# Altium schematic sheet main-board.SchDoc
size A; SheetNumber: 1; SheetTotal: 5
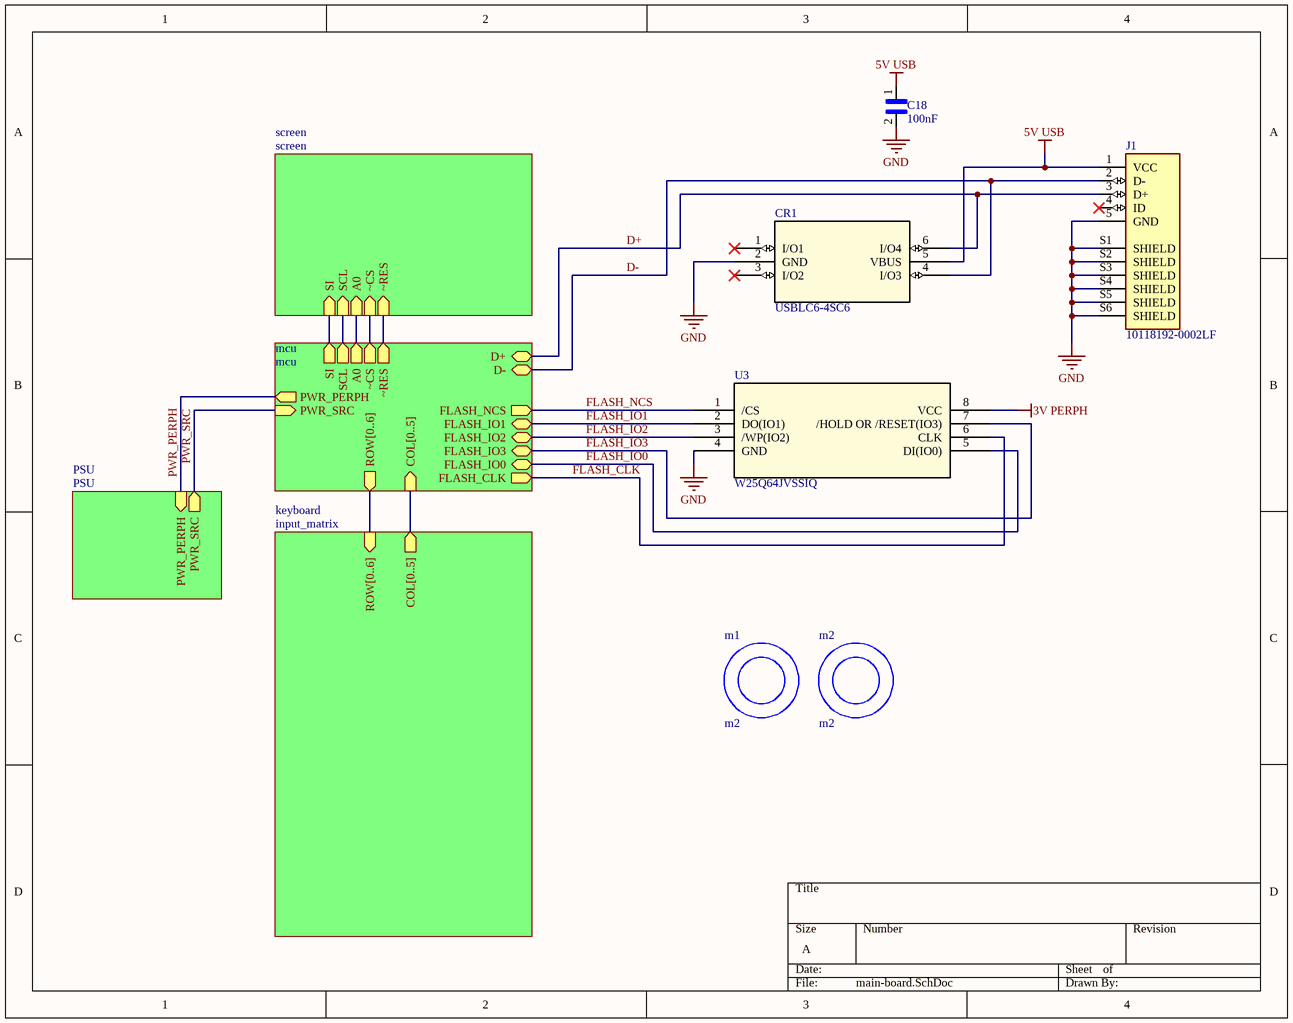
[diagram p0: main-board.SchDoc]

## Parts
C18  100nF  [CAPC1005X55N]
CR1  USBLC6-4SC6  [SOT23-6L_STM]
J1  10118192-0002LF  [AMPHENOL_10118192-0002LF]
m1  m2  [m2]
m2  m2  [m2]
U3  W25Q64JVSSIQ  [SOIC-8_5P28X5P28_WIN]

## Sub-sheets
keyboard = input_matrix: ROW[0..6] (in), COL[0..5] (out)
mcu = mcu: ROW[0..6] (out), COL[0..5] (in), SI (out), SCL (out), A0 (out), ~CS (out), ~RES (out), FLASH_IO1 (bidir), FLASH_IO0 (bidir), FLASH_CLK (out), FLASH_NCS (out), FLASH_IO2 (bidir), FLASH_IO3 (bidir), PWR_SRC (in), D- (bidir), D+ (bidir), PWR_PERPH (out)
PSU = PSU: PWR_SRC (out), PWR_PERPH (in)
screen = screen: SI (in), SCL (in), A0 (in), ~CS (in), ~RES (in)

## Nets
3V PERPH: U3.8(VCC)
5V USB: C18.1 CR1.5(VBUS) J1.1(VCC)
GND: C18.2 CR1.2(GND) J1.5(GND) J1.S1(SHIELD) J1.S2(SHIELD) J1.S3(SHIELD) J1.S4(SHIELD) J1.S5(SHIELD) J1.S6(SHIELD) U3.4(GND)
D+: CR1.6(I/O4) J1.3(D+) ; sheet mcu/D+
D-: CR1.4(I/O3) J1.2(D-) ; sheet mcu/D-
FLASH_CLK: U3.6(CLK) ; sheet mcu/FLASH_CLK
FLASH_IO0: U3.5(DI(IO0)) ; sheet mcu/FLASH_IO0
FLASH_IO1: U3.2(DO(IO1)) ; sheet mcu/FLASH_IO1
FLASH_IO2: U3.3(/WP(IO2)) ; sheet mcu/FLASH_IO2
FLASH_IO3: U3.7(/HOLD_OR_/RESET(IO3)) ; sheet mcu/FLASH_IO3
FLASH_NCS: U3.1(/CS) ; sheet mcu/FLASH_NCS
PWR_PERPH: sheet mcu/PWR_PERPH, sheet PSU/PWR_PERPH
PWR_SRC: sheet mcu/PWR_SRC, sheet PSU/PWR_SRC
(unnamed): sheet mcu/SI, sheet screen/SI
(unnamed): sheet mcu/SCL, sheet screen/SCL
(unnamed): sheet mcu/A0, sheet screen/A0
(unnamed): sheet mcu/~CS, sheet screen/~CS
(unnamed): sheet mcu/~RES, sheet screen/~RES

Not connected (* = marked no-connect by the designer): CR1 1(I/O1)* 3(I/O2)*; J1 4(ID)*

## Buses and harness runs
bus sheet keyboard/COL[0..5] = sheet mcu/COL[0..5]
bus sheet keyboard/ROW[0..6] = sheet mcu/ROW[0..6]

## Library data of the parts
C18 = CL05B104KP5NNNC: 0.1ÂµF Â±10% 10V Ceramic Capacitor X7R 0402 _1005 Metric_; MF: Samsung Electro-Mechanics; MP: CL05B104KP5NNNC; Availability: Unavailable; SnapEDA_Link: https://www.snapeda.com/parts/CL05B104KP5NNNC/Samsung%20Electro-Mechanics/view-part/1365387/?ref=snap; Package: 0402 Samsung; Price: None; Value: *
CR1 = USBLC6-4SC6: No Description Available; Mfr_Name: STMicroelectronics; RefDes: RefDes; Type: Type
J1 = 10118192-0002LF: Micro USB 2.0, Input Output Connectors, B TYPE RECEPTACLE without flange; MF: Amphenol ICC; SnapEDA_Link: https://www.snapeda.com/parts/10118192-0002LF/Amphenol+FCI/view-part/?ref=snap; Package: None; Value: *; MP: 10118192-0002LF; Check_prices: https://www.snapeda.com/parts/10118192-0002LF/Amphenol+FCI/view-part/?ref=eda
U3 = W25Q64JVSSIQ: W25Q64JVSSIQ. 64MBit Quad-SPI flash; Mfr_Name: Winbond; RefDes: RefDes; Type: Type